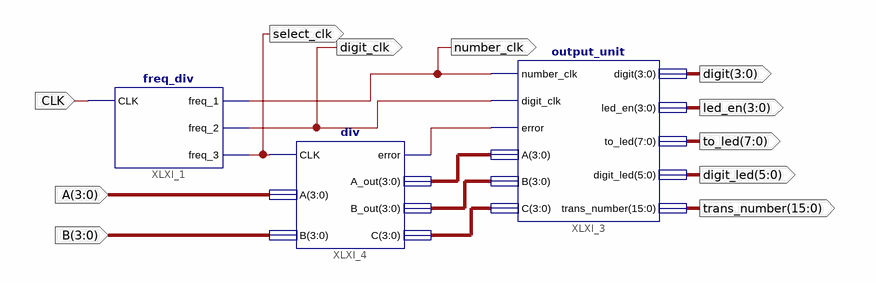
[diagram p0: schematic sheet 1]
// Xilinx ISE schematic main.sch (spartan3e) as structural Verilog: 3 symbols, 11 ports
module main (
  input  CLK,
  input  [3:0] A,
  input  [3:0] B,
  output select_clk,
  output number_clk,
  output digit_clk,
  output [3:0] led_en,
  output [7:0] to_led,
  output [5:0] digit_led,
  output [15:0] trans_number,
  output [3:0] digit
);

  wire XLXN_8;
  wire [3:0] XLXN_15, XLXN_16, XLXN_17;

  freq_div XLXI_1 (.CLK(CLK), .freq_1(number_clk), .freq_2(digit_clk), .freq_3(select_clk));
  output_unit XLXI_3 (
    .number_clk(number_clk), .digit_clk(digit_clk), .error(XLXN_8), .A(XLXN_15), .B(XLXN_16), .C(XLXN_17),
    .digit(digit), .led_en(led_en), .to_led(to_led), .digit_led(digit_led), .trans_number(trans_number));
  div XLXI_4 (.CLK(select_clk), .A(A), .B(B), .error(XLXN_8), .A_out(XLXN_15), .B_out(XLXN_16), .C(XLXN_17));
endmodule
